# EAGLE design AD5242BRZ1M_ad8220 (EAGLE 8.3.2)
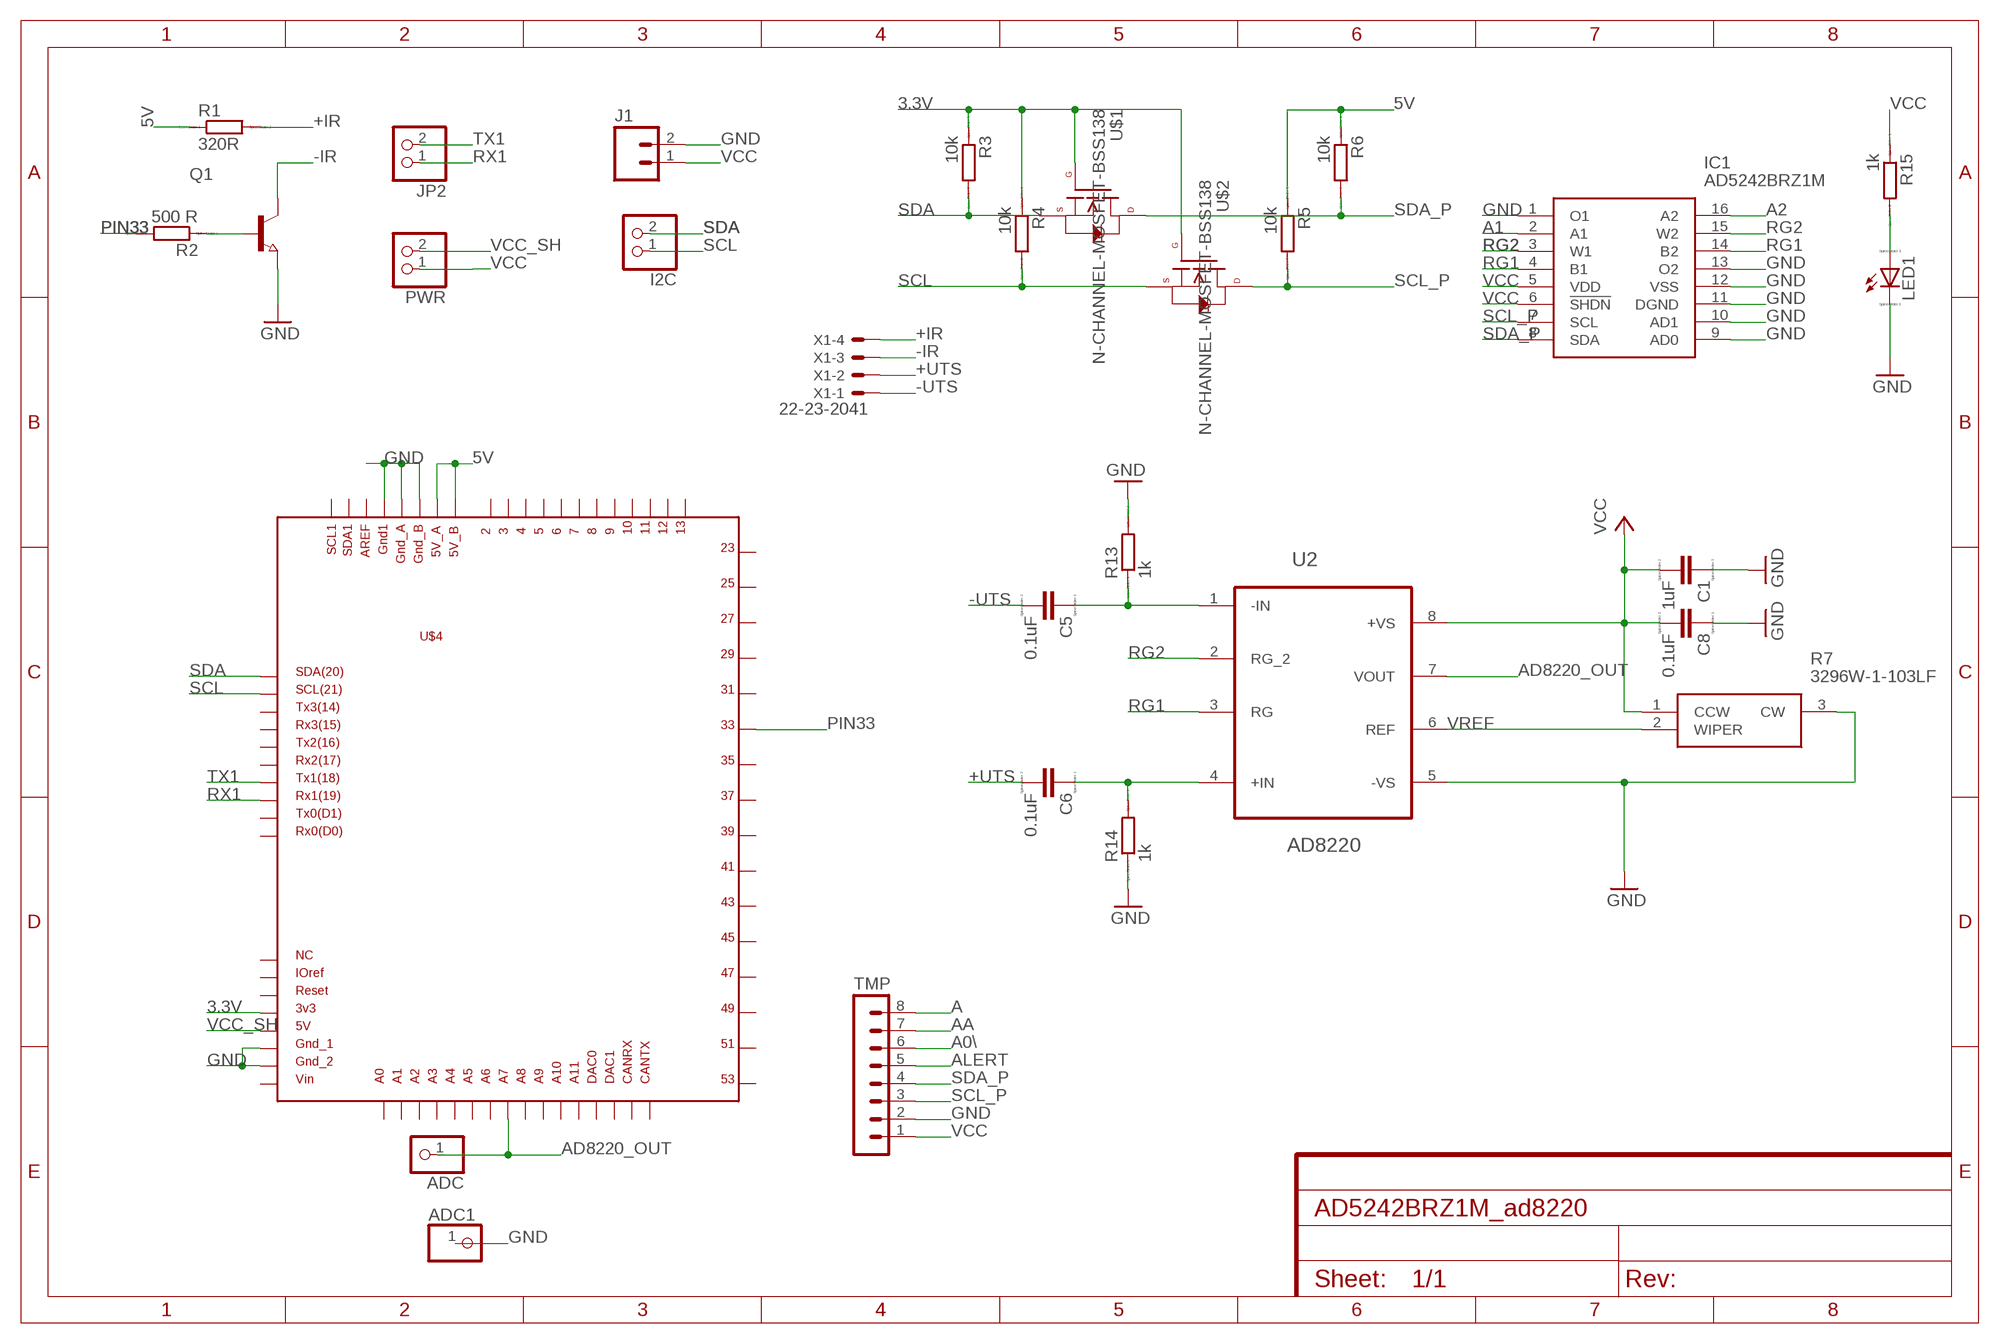
[diagram p0: schematic, sheet 1]

## Parts
ADC  PINHD-1X1  [1X01]
ADC1  PINHD-1X1  [1X01]
C1  1uF  CC0603  [C0603]
C5  0.1uF  CC0603  [C0603]
C6  0.1uF  CC0603  [C0603]
C8  0.1uF  CC0603  [C0603]
I2C  PINHD-1X2  [1X02]
IC1  AD5242BRZ1M  [SOIC127P600X175-16N]
J1  M02POLAR_LOCK  [MOLEX-1X2_LOCK]
JP2  PINHD-1X2  [1X02]
LED1  LED_E  [LED_1206]
PWR  PINHD-1X2  [1X02]
Q1  NPN-TRANSISTOR_SOT23  [SOT23]
R1  320R  RR0603  [R0603]
R2  500 R  RR0603  [R0603]
R3  10k  RR0603  [R0603]
R4  10k  RR0603  [R0603]
R5  10k  RR0603  [R0603]
R6  10k  RR0603  [R0603]
R7  3296W-1-103LF  [SHDR3W54P0X254_1X3_953X483X115]
R13  1k  RR0603  [R0603]
R14  1k  RR0603  [R0603]
R15  1k  RR0603  [R0603]
TMP  MA08-1  [MA08-1]
U2  AD8220  AD8220ARMZ  [SOP65P490X110-8N]
U$1  N-CHANNEL-MOSFET-BSS138  [SOT23-3]
U$2  N-CHANNEL-MOSFET-BSS138  [SOT23-3]
U$4  DUE_MAD  [DUE_MAD]
X1  22-23-2041  [22-23-2041]

## Nets
3.3V: R3.1 R4.1 U$1.1(G) U$2.1(G) U$4.3V3
5V: R1.1 R5.1 R6.1 U$4.5V_A U$4.5V_B
+IN: C6.1 R14.2 U2.4(+IN)
+IR: R1.2 X1.4
+UTS: C6.2 X1.2
-IN: C5.1 R13.1 U2.1(-IN)
-IR: Q1.3(C) X1.3
-UTS: C5.2 X1.1
A: TMP.8
A0\: TMP.6
A1: IC1.2(A1)
A2: IC1.16(A2)
AA: TMP.7
AD8220_OUT: ADC.1 U2.7(VOUT) U$4.A7
ALERT: TMP.5
GND: ADC1.1 C1.1 C8.1 IC1.1(O1) IC1.9(AD0) IC1.10(AD1) IC1.11(DGND) IC1.12(VSS) IC1.13(O2) J1.2 LED1.C Q1.2(E) R7.3(CW) R13.2 R14.1 TMP.2 U2.5(-VS) U$4.GND1 U$4.GND_1 U$4.GND_2 U$4.GND_A U$4.GND_B
N$2: LED1.A R15.2
N$3: Q1.1(B) R2.1
PIN33: R2.2 U$4.33
RG1: IC1.4(B1) IC1.14(B2) U2.3(RG)
RG2: IC1.3(W1) IC1.15(W2) U2.2(RG_2)
RX1: JP2.1 U$4.RX1
SCL: I2C.1 R4.2 U$2.2(S) U$4.SCL
SCL_P: IC1.7(SCL) R5.2 TMP.3 U$2.3(D)
SDA: I2C.2 R3.2 U$1.2(S) U$4.SDA
SDA_P: IC1.8(SDA) R6.2 TMP.4 U$1.3(D)
TX1: JP2.2 U$4.TX1
VCC: C1.2 C8.2 IC1.5(VDD) IC1.6(!SHDN) J1.1 PWR.1 R7.1(CCW) R15.1 TMP.1 U2.8(+VS)
VCC_SH: PWR.2 U$4.5V
VREF: R7.2(WIPER) U2.6(REF)
Unconnected: U$4.2 U$4.3 U$4.4 U$4.5 U$4.6 U$4.7 U$4.8 U$4.9 U$4.10 U$4.11 U$4.12 U$4.13 U$4.23 U$4.25 U$4.27 U$4.29 U$4.31 U$4.35 U$4.37 U$4.39 U$4.41 U$4.43 U$4.45 U$4.47 U$4.49 U$4.51 U$4.53 U$4.A0 U$4.A1 U$4.A2 U$4.A3 U$4.A4 U$4.A5 U$4.A6 U$4.A8 U$4.A9 U$4.A10 U$4.A11 U$4.AREF U$4.AREF1(AREF) U$4.CANRX U$4.CANTX U$4.DAC0 U$4.DAC1 U$4.IOREF U$4.NC U$4.RESET U$4.RX0 U$4.RX2 U$4.RX3 U$4.SCL1 U$4.SDA1 U$4.TX0 U$4.TX2 U$4.TX3 U$4.VIN

## Library data of the parts
ADC ADC1 = pinhead:PINHD-1X1: PIN HEADER
C1 C5 C6 C8 = eagle-ltspice:C: CAPACITOR, European symbol; SPICEMODEL: NONE; SPICEPREFIX: C
I2C JP2 PWR = pinhead:PINHD-1X2: PIN HEADER
IC1 = AD5242BRZ1M:AD5242BRZ1M: AD5242BRZ1M, Digital Potentiometer 1000k 256-Position 2-channel Serial-2 Wire, Serial-I2C 16-Pin SOIC N Source: Datasheet <http://www.analog.com/media/en/technical-documentation/data-sheets/AD5241_5242.pdf>; DESCRIPTION: AD5242BRZ1M, Digital Potentiometer 1000k 256-Position 2-channel Serial-2 Wire, Serial-I2C 16-Pin SOIC N; HEIGHT: 1.75mm; MANUFACTURER_NAME: Analog Devices; MANUFACTURER_PART_NUMBER: AD5242BRZ1M; RS_PART_NUMBER: 5387762P; SUPPLIER_NAME: RS
J1 = SparkFun-Connectors:M02: Standard 2-pin 0.1" header. Use with - straight break away headers ( PRT-00116) - right angle break away headers (PRT-00553) - swiss pins (PRT-00743) - machine pins (PRT-00117) - female headers (PRT-00115) Molex polarized connector foot print use with: PRT-08233 with associated crimp pins and housings. 2.54_SCREWTERM for use with PRT-10571. 3.5mm Screw Terminal footprints for PRT-08084 5mm Screw Terminal footprints for use with PRT-08432
LED1 = eagle-ltspice:LED_E: LED Source: http://www.osram.convergy.de Source: www.luxeon.com Source: www.kingbright.com; SPICEMODEL: NONE; SPICEPREFIX: D; SPICETYPE: diode
Q1 = semicon-smd-ipc:NPN-TRANSISTOR_: NPN TRANSISTOR
R1-R6 R13-R15 = eagle-ltspice:R: RESISTOR, European symbol; SPICEMODEL: NONE; SPICEPREFIX: R
R7 = 3296W-1-103LF:3296W-1-103LF: Bourns 3296W Series 25-Turn Through Hole Cermet Trimmer Resistor with Pin Terminations, 10000???? ????10% 1/2W ????100ppm/????C Source: Datasheet <http://docs-europe.electrocomponents.com/webdocs/069c/0900766b8069ccf4.pdf>; ALLIED_NUMBER: 70153918; ALLIED_PRICE/STOCK: http://www.alliedelec.com/bourns-3296w-1-103lf/70153918/; DESCRIPTION: Bourns 3296W Series 25-Turn Through Hole Cermet Trimmer Resistor with Pin Terminations, 10000???? ????10% 1/2W ????100ppm/????C; HEIGHT: 11.55mm; MANUFACTURER_NAME: Bourns; MANUFACTURER_PART_NUMBER: 3296W-1-103LF; RS_PART_NUMBER: 1673377; RS_PRICE/STOCK: http://uk.rs-online.com/web/p/products/1673377
TMP = con-lstb:MA08-1: PIN HEADER; OC_FARNELL: unknown; OC_NEWARK: unknown
U2 = AD8220:AD8220ARMZ: JFET Input Instrumentation Amplifier with JFET Input Instrumentation Amplifier with Rail-to-Rail Output in MSOP Package; MPN: AD8220ARMZ; OC_FARNELL: 1274225; OC_NEWARK: unknown; PACKAGE: MSOP-8; SUPPLIER: Analog Devices
U$1 U$2 = GeekAmmo:N-CHANNEL-MOSFET: N-Channel MOSFET Mode Field Effect Transistor; DATASHEET: http://www.fairchildsemi.com/ds/BS/BSS138.pdf; DIGIKEY: BSS138TR-ND; ELEMENT14: 2323154; URL: http://au.element14.com/fairchild-semiconductor/bss138/mosfet-n-ch-50v-220ma-sot-23/dp/2323154
U$4 = due_mad:DUE_MAD
X1 = con-molex:22-23-2041: .100" (2.54mm) Center Header - 4 Pin; MF: MOLEX; MPN: 22-23-2041; OC_FARNELL: 1462920; OC_NEWARK: 38C0355

## Board
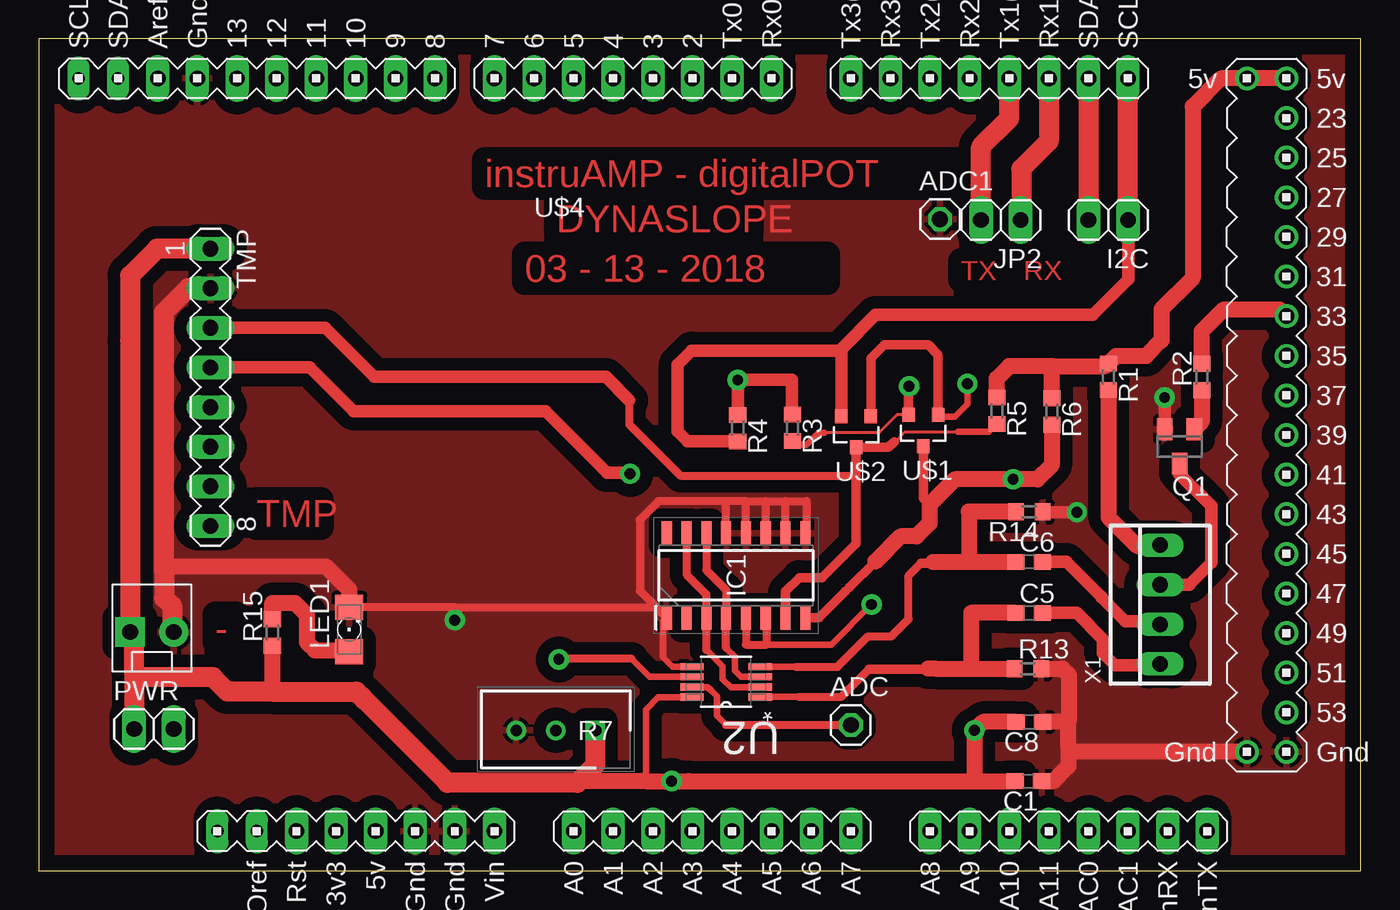
[diagram p1: board, top side]
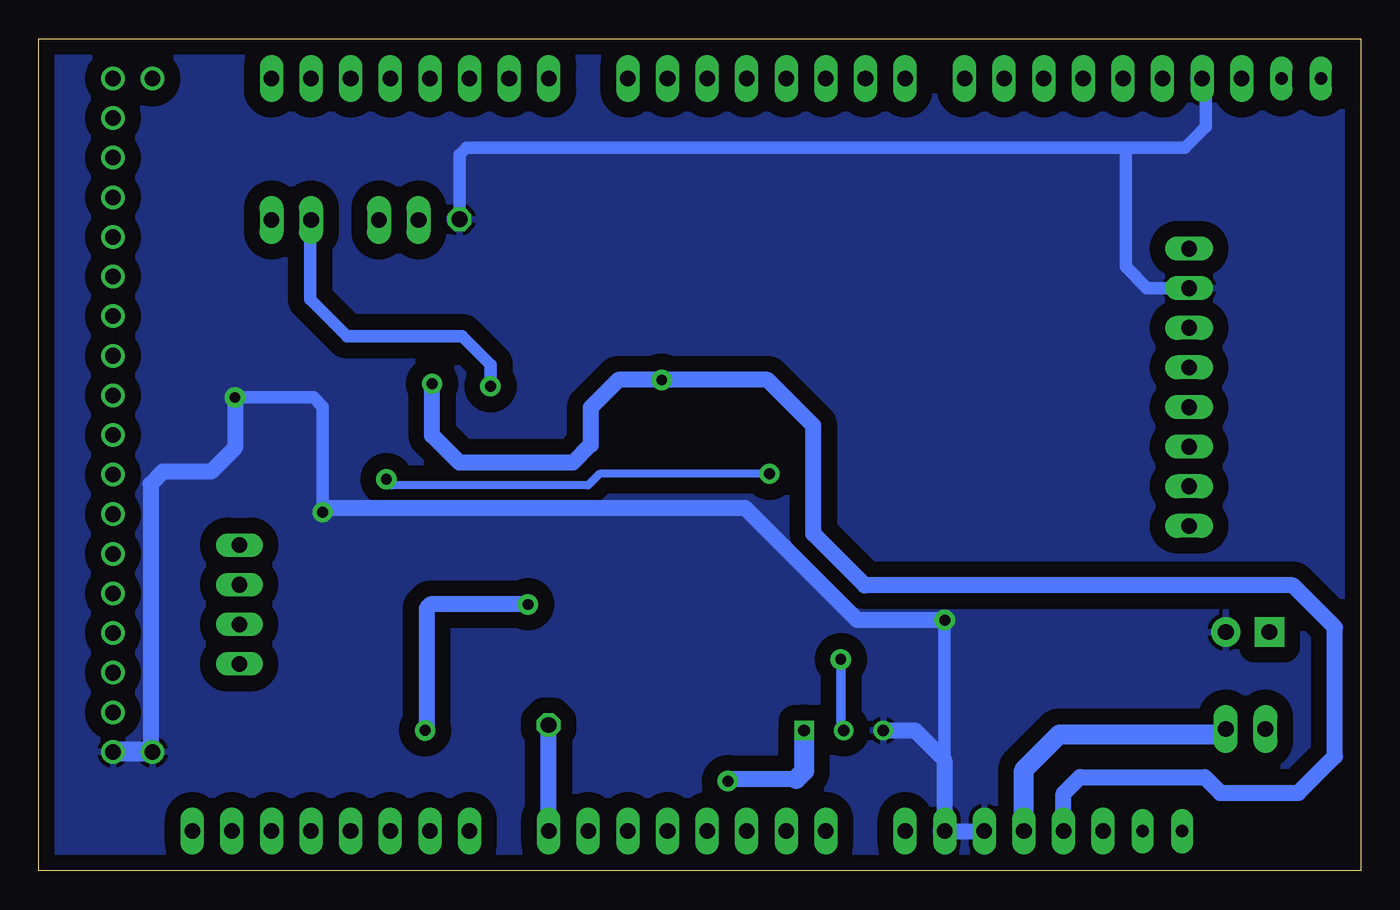
[diagram p2: board, bottom side, seen from below]

Size 84.76 x 53.33 mm. Coordinates in mm from the lower left corner, seen from the top.
Outline: 0,0 84.76,0 84.76,53.33 0,53.33 0,0
Copper layers (1*16): Top 0.035mm / dielectric 1.5mm / Bottom 0.035mm
Design rules "default": minimum track width 6mil, minimum drill 0.35mm, track to track 6mil, track to pad 6mil, pad to pad 6mil, via to via 6mil, smd to smd 6mil, copper to edge 40mil, drill to drill 6mil, minimum pad ring 10mil, minimum via ring 8mil, stop-mask expansion 4mil, vias tented up to drill 0mil, thermal gap 10mil

### Footprints (pad centres in the part's own frame; a part is rotated, then mirrored left to right if it is on the bottom)
1X01 = drill 1.016 octagon: 1 0,0
C0603 = smd 1.1 x 1: 1 -0.85,0; 2 0.85,0
1X02 = drill 1.016 long: 1 -1.27,0; 2 1.27,0
SOIC127P600X175-16N = smd 1.525 x 0.65: 1 -2.712,4.445; 2 -2.712,3.175; 3 -2.712,1.905; 4 -2.712,0.635; 5 -2.712,-0.635; 6 -2.712,-1.905; 7 -2.712,-3.175; 8 -2.712,-4.445; 9 2.712,-4.445; 10 2.712,-3.175; 11 2.712,-1.905; 12 2.712,-0.635; 13 2.712,0.635; 14 2.712,1.905; 15 2.712,3.175; 16 2.712,4.445
MOLEX-1X2_LOCK = drill 1.016 pad 1.88 square: 1 -0.127,0 | drill 1.016 pad 1.88: 2 2.667,0
LED_1206 = smd 1.6 x 1.803: A -1.422,0; C 1.422,0
SOT23 = smd 1 x 1.4: 1 -0.95,-1.1; 2 0.95,-1.1; 3 0,1.1
R0603 = smd 1 x 1.1: 1 -0.85,0; 2 0.85,0
SHDR3W54P0X254_1X3_953X483X115 = drill 0.75 pad 1.15 square: 1 0,0 | drill 0.75 pad 1.15: 2 -2.54,0; 3 -5.08,0
MA08-1 = drill 1.016 long: 1 -8.89,0; 2 -6.35,0; 3 -3.81,0; 4 -1.27,0; 5 1.27,0; 6 3.81,0; 7 6.35,0; 8 8.89,0
SOP65P490X110-8N = smd 1.499 x 0.457: 1 -2.184,0.965; 2 -2.184,0.33; 3 -2.184,-0.33; 4 -2.184,-0.965; 5 2.184,-0.965; 6 2.184,-0.33; 7 2.184,0.33; 8 2.184,0.965
SOT23-3 = smd 0.8 x 0.9: 1 -0.95,-1; 2 0.95,-1; 3 0,1
DUE_MAD = drill 1 long: 2 -6.35,22.86; 3 -8.89,22.86; 3V3 -29.21,-25.4; 4 -11.43,22.86; 5 -13.97,22.86; 5V -26.67,-25.4; 6 -16.51,22.86; 7 -19.05,22.86; 8 -22.86,22.86; 9 -25.4,22.86; 10 -27.94,22.86; 11 -30.48,22.86; 12 -33.02,22.86; 13 -35.56,22.86; A0 -13.97,-25.4; A1 -11.43,-25.4; A2 -8.89,-25.4; A3 -6.35,-25.4; A4 -3.81,-25.4; A5 -1.27,-25.4; A6 1.27,-25.4; A7 3.81,-25.4; A8 8.89,-25.4; A9 11.43,-25.4; A10 13.97,-25.4; A11 16.51,-25.4; AREF -40.64,22.86; AREF1 -40.64,22.86; CANRX 24.13,-25.4; CANTX 26.67,-25.4; DAC0 19.05,-25.4; DAC1 21.59,-25.4; GND1 -38.1,22.86; GND_1 -24.13,-25.4; GND_2 -21.59,-25.4; RESET -31.75,-25.4; RX0 -1.27,22.86; RX1 16.51,22.86; RX2 11.43,22.86; RX3 6.35,22.86; SCL 21.59,22.86; SDA 19.05,22.86; TX0 -3.81,22.86; TX1 13.97,22.86; TX2 8.89,22.86; TX3 3.81,22.86; VIN -19.05,-25.4 | drill 1: 5V_A 29.21,22.86; 5V_B 31.75,22.86; 23 31.75,20.32; 25 31.75,17.78; 27 31.75,15.24; 29 31.75,12.7; 31 31.75,10.16; 33 31.75,7.62; 35 31.75,5.08; 37 31.75,2.54; 39 31.75,0; 41 31.75,-2.54; 43 31.75,-5.08; 45 31.75,-7.62; 47 31.75,-10.16; 49 31.75,-12.7; 51 31.75,-15.24; 53 31.75,-17.78; GND_A 29.21,-20.32; GND_B 31.75,-20.32 | drill 0.8 pad 1.422 long: IOREF -34.29,-25.4; NC -36.83,-25.4; SCL1 -45.72,22.86; SDA1 -43.18,22.86
22-23-2041 = drill 1 long: 1 -3.81,0; 2 -1.27,0; 3 1.27,0; 4 3.81,0

### Placement (x,y rotation side)
ADC  52.07,9.35 0 top
ADC1  57.79,41.78 0 top
C1  63.46,5.75 180 top
C5  63.5,16.53 0 top
C6  63.5,19.81 0 top
C8  63.52,9.55 180 top
I2C  68.58,41.72 180 top
IC1  44.71,18.94 90 top
J1  5.97,15.31 0 top
JP2  61.69,41.72 180 top
LED1  19.9,15.47 90 top
PWR  7.37,9.09 0 top
Q1  73.15,27.21 180 top
R1  68.59,31.67 270 top
R2  74.58,31.66 90 top
R3  48.32,28.39 270 top
R4  44.82,28.38 270 top
R5  61.43,29.49 270 top
R6  64.96,29.45 270 top
R7  35.69,9 0 top
R13  63.42,12.96 0 top
R14  63.52,23.02 180 top
R15  14.97,15.28 90 top
TMP  11,31 270 top
U2  44.07,12.11 180 top
U$1  56.72,28.22 180 top
U$2  52.41,28.15 180 top
U$4  48.26,27.94 0 top
X1  71.92,17.07 90 top

### Tracks (layer width: path | path; a pad name or v marks a point on that pad's centre or on a via)
3.3V  (via drill 0.7 pad 1.3)
  Top 0.406: v59.55,31.23 59.55,29.91 58.76,29.12 57.77,29.12 U$1.1
  Top 0.61: U$1.1 57.67,33.09 57.04,33.72 54.22,33.72 53.36,32.86 U$2.1
  Top 0.813: R4.1 v44.82,31.47 48.3,31.47 48.3,29.24 R3.1
  Bottom 1.016: U$4.3V3 19.05,4.95 18,6 10,6 9,5 3.99,5 1.65,7.34 1.65,15.61 4.33,18.3 31.8,18.3 35.1,21.6 35.1,28.55 38.03,31.48 44.8,31.48 v44.82,31.47 47.6,31.47 49.38,29.69 49.38,27.3 50.51,26.17 57.8,26.17 59.55,27.92 v59.55,31.23
5V
  Top 1.016: U$4.5V_B U$4.5V_A 75.8,50.8 74,49 74,38 72,36 72,34 71,33 69.07,33 R1.1 68.42,32.35 65.02,32.35 | R5.1 61.43,31.55 62.23,32.35 65.02,32.35 | R6.1 64.96,32.29 65.02,32.35
+IN
  Top 0.406: U2.4 48.58,13.07 48.58,13.08
  Top 0.508: 48.58,13.07 51.22,13.07 53.18,15.03 54.67,15.03 55.77,16.13 55.77,18.92 56.56,19.71
  Top 0.61: 56.56,19.71 57.26,19.71 57.36,19.81
  Top 1.016: 59.64,19.81 C6.1 | 59.64,19.81 57.36,19.81 57.36,19.79 | R14.2 59.64,23.02 59.64,19.81
+IR
  Top 1.016: X1.4 71.05,20.82 70.45,20.82 68.59,22.68 R1.2
+UTS
  Top 0.813: C6.2 65.9,19.81 68.14,17.57 68.14,17.54 69.68,16 71.72,16 X1.2
-IN
  Top 0.406: U2.1 48.76,11.14 48.77,11.14
  Top 0.508: 48.77,11.14 51.46,11.14 53.24,12.93
  Top 0.61: 53.24,12.93 57.46,12.93 57.49,12.96
  Top 1.016: 59.77,12.96 R13.1 | 59.77,12.96 57.49,12.96 57.04,12.96 | 57.04,12.96 | C5.1 59.77,16.53 59.77,12.96
-IR
  Top 0.813: X1.3 73.78,18.34 75.18,19.74 75.18,23.39 73.11,25.47 73.11,26.07 Q1.3
-UTS
  Top 0.813: C5.2 66.57,16.53 68.24,14.86 68.24,13.96 69.01,13.19 71.84,13.19 X1.1
AD8220_OUT
  Top 0.406: U2.7 42.88,11.78 43.12,11.54 43.48,11.18 43.48,9.93 44.05,9.36
  Top 0.508: 44.05,9.36 ADC.1
  Bottom 1.016: U$4.A7 ADC.1
GND  (via drill 0.7 pad 1.3)
  Top 0.406: U2.5 40.64,13.07 40.02,13.69 40.02,15.98 IC1.1 | v26.66,16.08 26.66,16.8 26.76,16.89
  Top 0.508: IC1.13 44.07,23.71 | 46.61,23.71 47.88,23.71 | 45.34,23.71 46.61,23.71 | 45.34,23.71 44.07,23.71 | 47.88,23.71 49.24,23.71 49.24,21.65 IC1.9 | IC1.10 47.88,23.71 | IC1.11 46.61,23.71 | IC1.12 45.34,23.71 | 44.07,23.71 39.73,23.71 38.54,22.52 38.54,17.95 39.59,16.89 | LED1.C 26.76,16.89 39.59,16.89 | 39.59,16.89 IC1.1
  Top 0.813: Q1.2 72.2,30.34 v72.19,30.35 | v66.56,22.98 64.41,22.98 R14.1
  Top 1.016: LED1.C 19.9,18.01 18.4,19.51 8.33,19.51 8.03,19.21 | C8.1 65.92,9.55 66.03,9.66 | R13.2 65.65,12.96 66.08,12.53 66.08,9.71 66.03,9.66 | C1.1 65.07,5.75 65.94,6.62 65.94,6.63 66.03,6.72 66.03,7.92 | 66.03,7.92 66.03,9.66 | U$4.GND_A 66.33,7.62 66.03,7.92
  Top 1.27: TMP.2 9.57,37.35 8.03,35.8 8.03,19.21 8.03,17.51 8.53,17 8.53,15.41 J1.2
  Bottom 0.813: v72.19,30.35 67.15,30.35 66.56,29.76 v66.56,22.98 | 26.69,7.11 26.69,16.05 v26.66,16.08 | ADC1.1 57.79,45.91 57.33,46.37 15.06,46.37 | 15.06,46.37 11.25,46.37 9.93,47.69 9.93,50.57 U$4.GND1 | TMP.2 13.69,37.35 15.06,38.72 15.06,46.37
  Bottom 1.016: U$4.GND_1 U$4.GND_2 26.69,2.56 26.69,7.11 28.58,9 R7.3 | v72.19,30.35 72.19,27.12 73.73,25.59 76.81,25.59 77.61,24.79 77.61,7.76 U$4.GND_A | v26.66,16.08 32.28,16.08 39.45,23.25 66.3,23.25 v66.56,22.98
  Bottom 1.27: U$4.GND_A U$4.GND_B
  pour Top (isolate 0.813): 0.7,52.76 83.92,52.76 83.94,52.78 83.94,0.63 83.97,0.6 0.6,0.6 0.42,0.42 0.42,52.6 0.62,52.8 0.62,52.76 0.59,52.73
  pour Bottom (isolate 1.016): 0.6,52.84 84.04,52.84 84.1,52.9 84.1,0.49 84.09,0.48 0.56,0.48 0.54,0.46
N$2
  Top 1.016: R15.2 14.97,17.17 14.97,17.18 16.41,17.18 17.17,16.41 17.17,14.66 17.7,14.13 19.82,14.13 LED1.A
N$3
  Top 1.016: R2.1 74.58,28.79 Q1.1
PIN33
  Top 1.016: R2.2 74.58,34.58 76,36 79.57,36 U$4.33
RG1
  Top 0.406: U2.3 45.02,12.44 44.65,12.81 44.65,13.71 44.08,14.28
  Top 0.508: 44.08,14.28 IC1.4 44.07,18.01 42.8,19.27 IC1.14
RG2
  Top 0.406: U2.2 44.37,11.78 43.85,12.29 43.85,13.11 42.8,14.17
  Top 0.508: 42.8,14.17 IC1.3 42.78,16.24 42.78,17.74 41.53,19 IC1.15
RX1
  Top 1.27: U$4.RX1 64.77,46.77 63,45 63,41.76 JP2.1
SCL
  Top 0.813: 51.46,33.45 U$2.2 | 51.46,33.45 53.64,35.63 67.6,35.63 69.88,37.92 69.88,41.69 I2C.1 | R4.2 41.61,27.53 40.97,28.17 40.97,32.45 41.87,33.35 51.36,33.35 51.46,33.45
  Top 1.27: I2C.1 U$4.SCL
SCL_P
  Top 0.2: 54.85,27.52 54.92,27.52 55.55,28.14 58.93,28.14
  Top 0.406: 58.93,28.14 60.93,28.14 R5.2
  Top 0.508: 37.85,30.17 37.85,28.62 41.14,25.34 52.34,25.34 52.4,25.29
  Top 0.61: IC1.7 47.88,17.91 48.76,18.79 50.23,18.79 52.4,20.96 52.4,25.29 52.4,25.8 | 52.4,25.8 52.43,25.84 | 52.4,25.8 52.41,25.82 U$2.3 54.48,27.15 54.85,27.52
  Top 0.813: TMP.3 18.35,34.81 21.49,31.66 36.36,31.66 37.85,30.17
SDA  (via drill 0.7 pad 1.3)
  Top 0.2: U$1.2 55.03,29.23 53.89,28.08 50.39,28.08
  Top 0.406: 50.39,28.08 49.99,28.08 49.21,27.3 48.56,27.3 R3.2
  Top 0.61: U$1.2 55.77,31.03 v55.81,31.07
  Top 1.27: U$4.SDA I2C.2
  Bottom 0.813: v55.81,31.07 55.81,32.45 57.62,34.26 65,34.26 67.36,36.63 67.36,41.67 I2C.2
SDA_P  (via drill 0.7 pad 1.3)
  Top 0.406: 51.74,17.92 51.99,18.17
  Top 0.61: 51.99,18.17 51.99,18.18 53.64,19.83 | U$1.3 56.72,23.88 57.12,23.48 | IC1.8 50.04,16.23 51.74,17.92
  Top 0.813: TMP.4 17.36,32.27 20.18,29.45 32.48,29.45 36.42,25.51 37.85,25.51 v37.91,25.45
  Top 1.016: R6.2 64.96,26.01 64.04,25.1 v62.48,25.1 58.74,25.1 57.12,23.48 57.12,22.27 56.29,21.45 55.26,21.45 53.64,19.83
  Bottom 0.508: v37.91,25.45 48.81,25.45 49.55,24.71 62.09,24.71 v62.48,25.1
TX1
  Top 1.27: U$4.TX1 62.23,48.23 60.42,46.42 JP2.2
VCC  (via drill 0.7 pad 1.3)
  Top 0.406: U2.8 39.72,11.13 38.93,10.34 38.93,5.75 | 46.67,14.51 50.83,14.51 v53.4,17.07
  Top 0.508: IC1.5 45.34,14.51 46.67,14.51 46.67,16.23 IC1.6
  Top 0.813: 41.62,5.75 41.68,5.75
  Top 1.016: C8.2 60.55,9.55 v60,9 60,5.93 59.81,5.75 | R15.1 14.97,11.53 14.93,11.49 | 59.81,5.75 C1.2 | 59.81,5.75 41.68,5.75 v40.58,5.75 38.93,5.75 34.64,5.75 34.53,5.64
  Top 1.27: 6.1,12.68 PWR.1 | 6.1,12.68 6.1,15.04 J1.1 5.84,34.01 5.84,38.16 7.58,39.89 TMP.1 | R7.1 35.69,6.8 34.53,5.64 26.2,5.64 20.85,10.99 20.35,11.49 14.93,11.49 12.08,11.49 11.15,12.41 6.36,12.41 6.1,12.68
  Bottom 1.016: v53.4,17.07 59.65,17.07 59.9,16.83 59.9,9.1 v60,9 | 36.2,5.88 40.45,5.88 v40.58,5.75
  Bottom 1.27: R7.1 35.69,6.38 36.2,5.88
VCC_SH
  Bottom 1.27: U$4.5V 21.59,6.46 19.31,8.74 9.05,8.74 8.98,8.68 8.98,8.75 PWR.2
VREF  (via drill 0.7 pad 1.3)
  Top 0.406: U2.6 39.15,12.44 37.99,13.6
  Top 0.508: 37.99,13.6 33.39,13.6 v33.34,13.55
  Bottom 0.61: v33.34,13.55 33.34,9.19 R7.2

### Text on the board
Top: instruAMP - digitalPOT | DYNASLOPE | 03 - 13 - 2018 | TX | RX | TMP | -